# Altium schematic sheet ip_phone_codec.SchDoc: CODEC
size A3; SheetNumber: 3; SheetTotal: 6
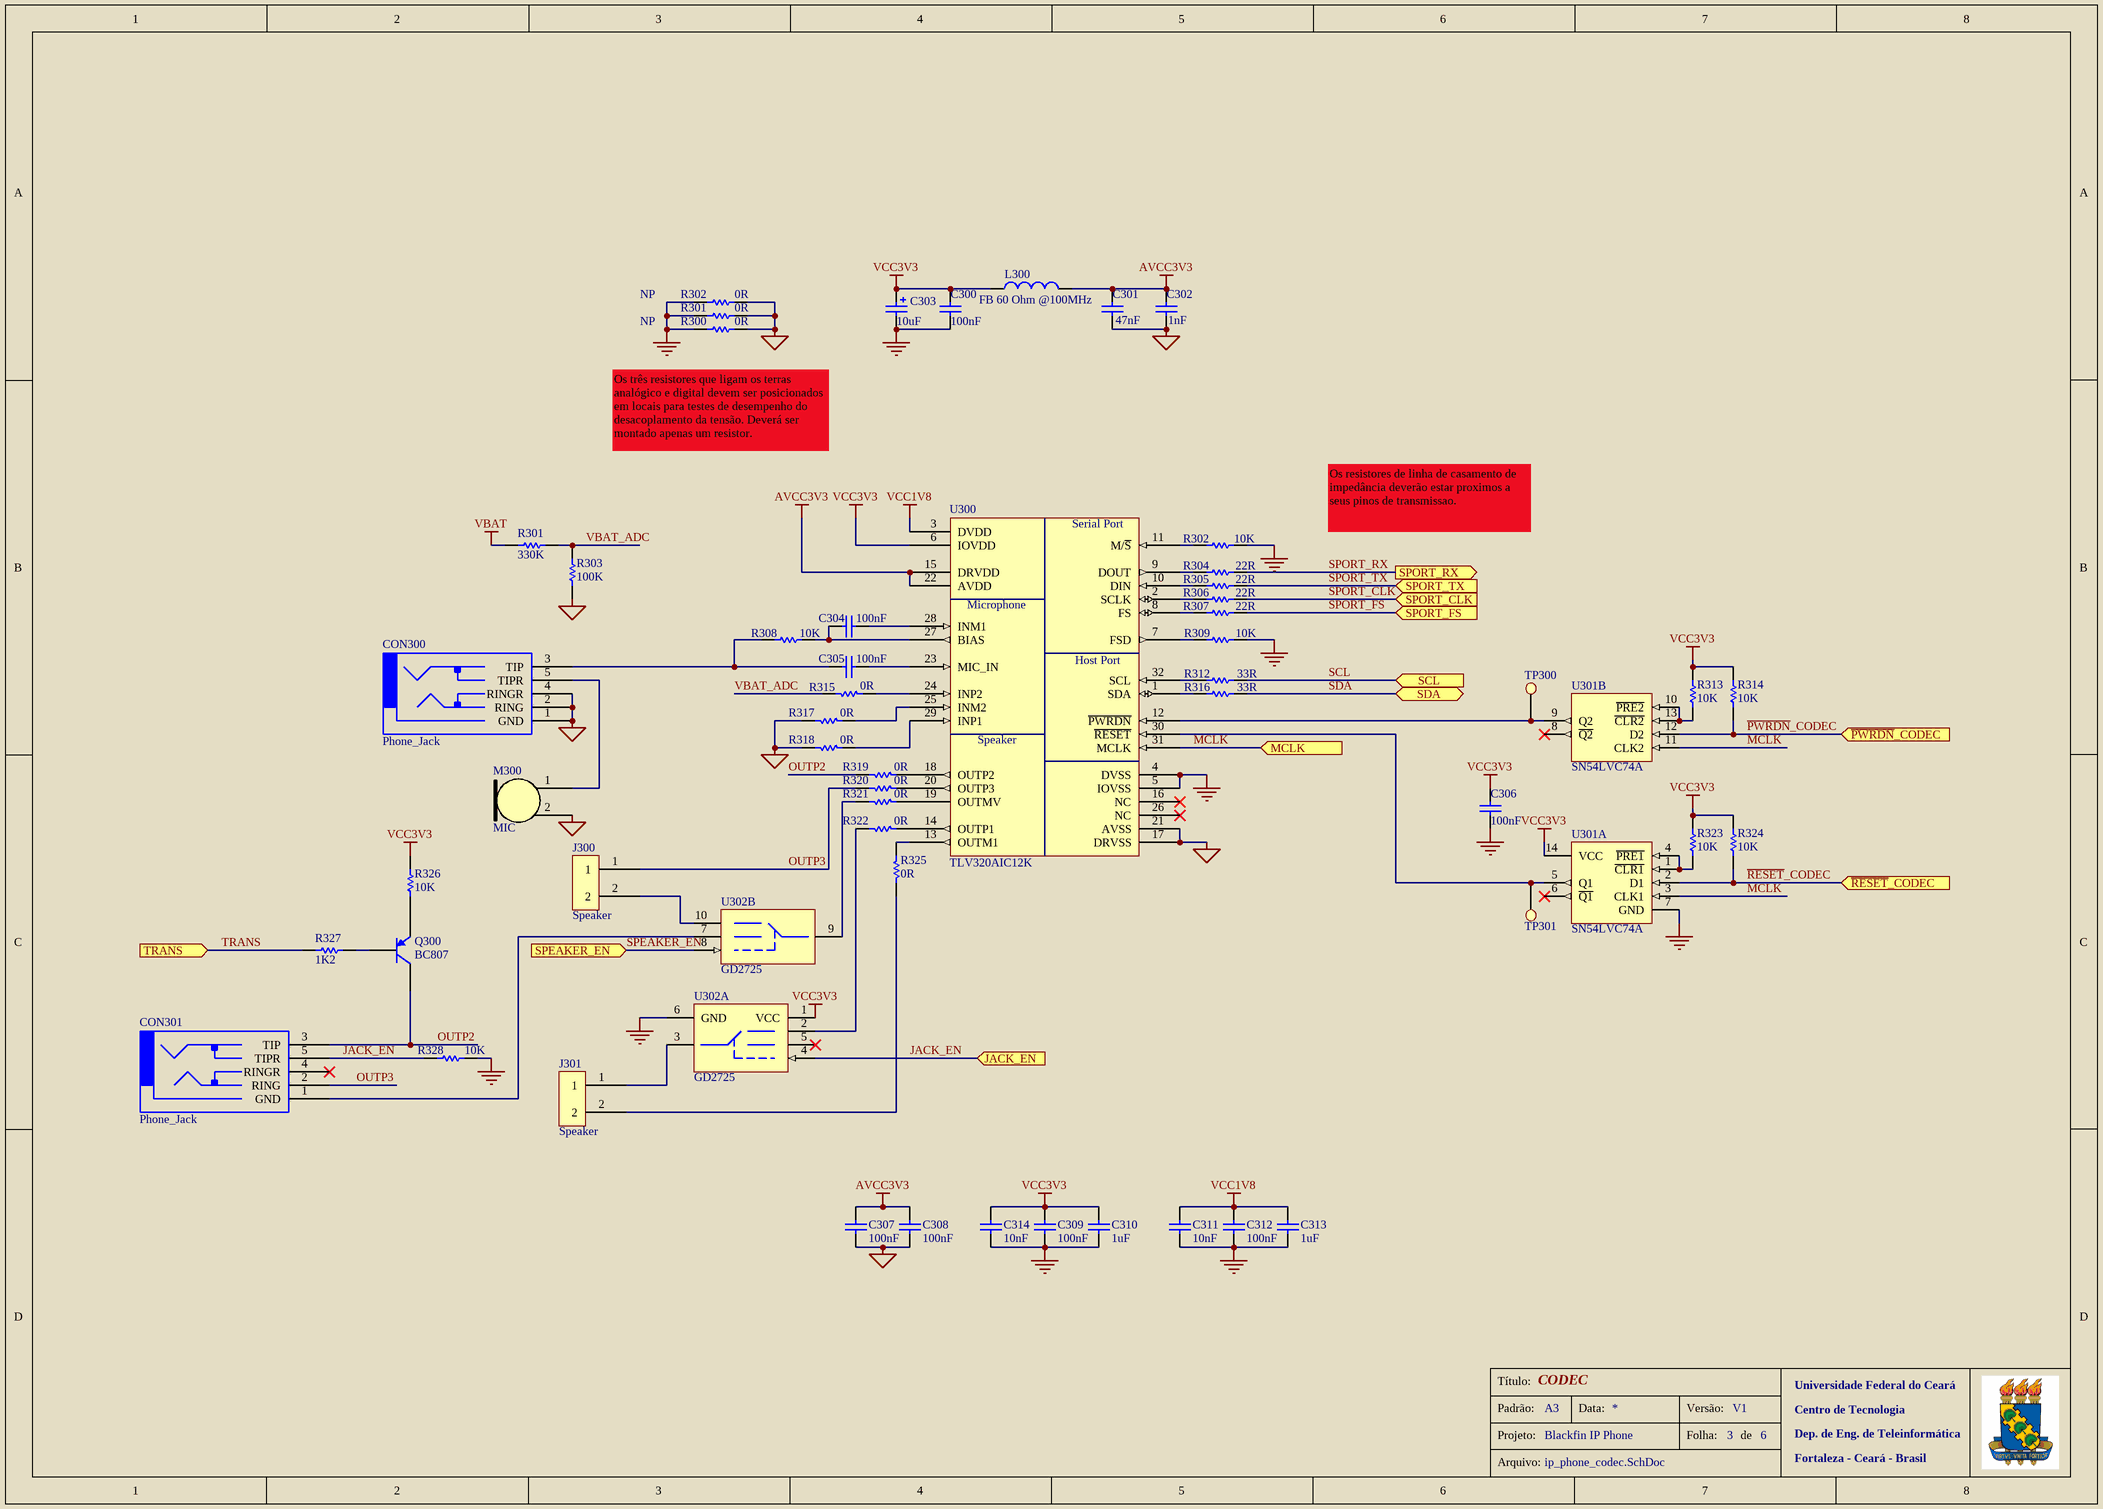
[diagram p0: ip_phone_codec.SchDoc]

## Parts
(Parts that share a designator on the sheet are numbered #1, #2 ... from top to bottom, then left to right.)
C300  100nF  [CC1005-0402]
C301  47nF  [CC1005-0402]
C302  1nF  [CC1005-0402]
C303  10uF  [VE-100M0JTR-0305]
C304  100nF  [CC1005-0402]
C305  100nF  [CC1005-0402]
C306  100nF  [CC1005-0402]
C307  100nF  [CC1005-0402]
C308  100nF  [CC1005-0402]
C309  100nF  [CC1005-0402]
C310  1uF  [CC1005-0402]
C311  10nF  [CC1005-0402]
C312  100nF  [CC1005-0402]
C313  1uF  [CC1005-0402]
C314  10nF  [CC1005-0402]
CON300  Phone_Jack  [Phone_Jack - 3.5]
CON301  Phone_Jack  [Phone_Jack - 3.5]
J300  Speaker  [HEADER_SPEAKER]
J301  Speaker  [HEADER_SPEAKER]
L300  FB 60 Ohm @100MHz  [INDUTOR_0603]
M300  MIC  [MIC]
Q300  BC807  [SOT323_N]
R300  0R  [CR1608-0603]
R301#1  0R  [CR1608-0603]
R301#2  330K  [CR1005-0402]
R302#1  0R  [CR1608-0603]
R302#2  10K  [CR1005-0402]
R303  100K  [CR1005-0402]
R304  22R  [CR1005-0402]
R305  22R  [CR1005-0402]
R306  22R  [CR1005-0402]
R307  22R  [CR1005-0402]
R308  10K  [CR1005-0402]
R309  10K  [CR1005-0402]
R312  33R  [CR1005-0402]
R313  10K  [CR1005-0402]
R314  10K  [CR1005-0402]
R315  0R  [CR1005-0402]
R316  33R  [CR1005-0402]
R317  0R  [CR1005-0402]
R318  0R  [CR1005-0402]
R319  0R  [CR1005-0402]
R320  0R  [CR1005-0402]
R321  0R  [CR1005-0402]
R322  0R  [CR1005-0402]
R323  10K  [CR1005-0402]
R324  10K  [CR1005-0402]
R325  0R  [CR1005-0402]
R326  10K  [CR1005-0402]
R327  1K2  [CR1005-0402]
R328  10K  [CR1005-0402]
TP300  Test Point  [Test Point]  (value not drawn)  (no BOM)
TP301  Test Point  [Test Point]  (value not drawn)  (no BOM)
U300  TLV320AIC12K  [PVQFN-32]
U301  SN54LVC74A  [SOIC14]  (parts A,B of 2)
U302  GD2725  [QFN10]  (parts A,B of 2)

## Ports
JACK_EN (in), MCLK (in), SCL (in), SDA (bidir), SPEAKER_EN (in), SPORT_CLK (in), SPORT_FS (in), SPORT_RX (out), SPORT_TX (in), TRANS (in), ~{PWRDN}_CODEC (in), ~{RESET}_CODEC (in)

## Nets
AGND: C301.1 C302.1 C307.1 C308.1 CON300.1(GND) CON300.2(RING) CON300.4(RINGR) M300.2(GND) R300.1 R301#1.1 R302#1.1 R303.1 R317.2 R318.2 U300.17(DRVSS) U300.21(AVSS)
AVCC3V3: C301.2 C302.2 C307.2 C308.2 L300.2 U300.15(DRVDD) U300.22(AVDD)
GND: C300.1 C303.2 C306.1 C309.2 C310.2 C311.1 C312.1 C313.1 C314.1 R300.2 R301#1.2 R302#1.2 R302#2.2 R309.2 R328.2 U300.4(DVSS) U300.5(IOVSS) U301.7(GND) U302.6(GND)
VBAT: R301#2.1
VCC1V8: C311.2 C312.2 C313.2 U300.3(DVDD)
VCC3V3: C300.2 C303.1 C306.2 C309.1 C310.1 C314.2 L300.1 R313.2 R314.2 R323.2 R324.2 R326.2 U300.6(IOVDD) U301.14(VCC) U302.1(VCC)
JACK_EN: CON301.5(TIPR) R328.1 U302.4(IN1) ; port JACK_EN
MCLK: U300.31(MCLK) U301.3(CLK1) U301.11(CLK2) ; port MCLK
OUTP2: CON301.3(TIP) Q300.2(E) R319.2
OUTP3: CON301.2(RING) J300.1 R320.2
~{PWRDN}_CODEC: R314.1 U301.12(D2) ; port ~{PWRDN}_CODEC
~{RESET}_CODEC: R324.1 U301.2(D1) ; port ~{RESET}_CODEC
SCL: R312.2 ; port SCL
SDA: R316.2 ; port SDA
SPEAKER_EN: U302.8(IN2) ; port SPEAKER_EN
SPORT_CLK: R306.2 ; port SPORT_CLK
SPORT_FS: R307.2 ; port SPORT_FS
SPORT_RX: R304.2 ; port SPORT_RX
SPORT_TX: R305.2 ; port SPORT_TX
TRANS: R327.1 ; port TRANS
VBAT_ADC: R301#2.2 R303.2 R315.2
NetC304_1: C304.1 U300.28(INM1)
NetC304_2: C304.2 R308.2 U300.27(BIAS)
NetC305_1: C305.1 U300.23(MIC_IN)
NetC305_2: C305.2 CON300.3(TIP) R308.1
NetCON300_5: CON300.5(TIPR) M300.1(OUT)
NetCON301_1: CON301.1(GND) U302.7(NC2)
NetJ300_2: J300.2 U302.10(NO2)
NetJ301_1: J301.1 U302.3(COM1)
NetJ301_2: J301.2 R325.2
NetQ300_1: Q300.1(B) R327.2
NetQ300_3: Q300.3(C) R326.1
NetR302#2_1: R302#2.1 U300.11(M/~{S})
NetR304_1: R304.1 U300.9(DOUT)
NetR305_1: R305.1 U300.10(DIN)
NetR306_1: R306.1 U300.2(SCLK)
NetR307_1: R307.1 U300.8(FS)
NetR309_1: R309.1 U300.7(FSD)
NetR312_1: R312.1 U300.32(SCL)
NetR313_1: R313.1 U301.10(~{PRE2}) U301.13(~{CLR2})
NetR315_1: R315.1 U300.24(INP2)
NetR316_1: R316.1 U300.1(SDA)
NetR317_1: R317.1 U300.25(INM2)
NetR318_1: R318.1 U300.29(INP1)
NetR319_1: R319.1 U300.18(OUTP2)
NetR320_1: R320.1 U300.20(OUTP3)
NetR321_1: R321.1 U300.19(OUTMV)
NetR321_2: R321.2 U302.9(COM2)
NetR322_1: R322.1 U300.14(OUTP1)
NetR322_2: R322.2 U302.2(NO1)
NetR323_1: R323.1 U301.1(~{CLR1}) U301.4(~{PRE1})
NetR325_1: R325.1 U300.13(OUTM1)
NetTP300_1: TP300.1 U300.12(~{PWRDN}) U301.9(Q2)
NetTP301_1: TP301.1 U300.30(~{RESET}) U301.5(Q1)

Not connected (* = marked no-connect by the designer): CON301 4(RINGR)*; U300 16(NC)* 26(NC)*; U301 6(~{Q1})* 8(~{Q2})*; U302 5(NC1)*

## Notes on the sheet
- Os três resistores que ligam os terras analógico e digital devem ser posicionados em locais para testes de desempenho do desacoplamento da tensão. Deverá ser montado apenas um resistor.
- Os resistores de linha de casamento de impedância deverão estar proximos a seus pinos de transmissao.
- Título:
- Universidade Federal do Ceará
- Padrão:
- Projeto:
- A3
- Blackfin IP Phone
- Data:
- Versão:
- Folha:
- V1
- de
- Centro de Tecnologia
- Dep. de Eng. de Teleinformática
- Fortaleza - Ceará - Brasil
- Arquivo:
- (in symbol TLV320AIC12K) Serial Port; Microphone; Host Port; Speaker

## Library data of the parts
C300 = Capacitor: MLCC - SMD/SMT 100nF 16V 10% 0402; eVendorPart#: 810-C1005X7R1C104K; Manufacturer: TDK; Part#: C1005X7R1C104KT; eVendor: Mouser; eVendorPrice: 0,03; MSRP: 0,005; MOQ: 1000
C301 = Capacitor: MLCC - SMD/SMT 47nF 16V 10% 0402; eVendorPart#: 311-1334-1-ND; Manufacturer: Yageo; Part#: CC0402KRX7R6BB473; eVendor: Digikey; eVendorPrice: 0,02; MSRP: 0,00429; MOQ: 1000
C302 = Capacitor: MLCC - SMD/SMT 1nF 16V 10% 0402; eVendorPart#: 311-1352-1-ND; Manufacturer: Yageo; Part#: CC0402KRX7R7BB102; eVendor: Digikey; eVendorPrice: 0,015; MSRP: 0,00335; MOQ: 1000
C303 = Capacitor_Electrolytic: Aluminum Electrolytic Capacitors - SMD 6.3 Volts 10uF 20%; eVendorPart#: 140-VE100M0JTR0305; Manufacturer: Lelon; eVendor: Mouser; MSRP: 0,099; eVendorPrice: 0,18; Part#: VE-100M0JTR-0305; MOQ: 1000
C304-C309 C312 = Capacitor: MLCC - SMD/SMT 0.1UF 16V 10% 0402; eVendorPart#: 810-C1005X7R1C104K; Manufacturer: TDK; Part#: C1005X7R1C104KT; eVendor: Mouser; eVendorPrice: 0,03; MSRP: 0,005; MOQ: 1000
C310 C313 = Capacitor: CAP CER 1.0UF 6.3V 20% X5R 0402; eVendorPart#: 490-1319-1-ND; Manufacturer: Murata Electronics North America; Part#: GRM155R60J105ME19D; eVendor: Digikey; eVendorPrice: 0,055; MSRP: 0,01193; MOQ: 1000
C311 C314 = Capacitor: Ceramic Capacitor 10nF 50V X7R 0402; eVendorPart#: 810-C1005X7R1C103K; Manufacturer: TDK; Part#: C1005X7R1C103KT; eVendor: Mouser; eVendorPrice: 0,03; MSRP: 0,004; MOQ: 1000
CON300 CON301 = Phone_Jack: CONN JACK STEREO 5PIN 3.5MM; eVendorPart#: 502-35RAPC4BHN2; Manufacturer: Switchcraft; Part#: 35RAPC4BHN2; eVendorPrice: 1,02; eVendor: Mouser; MSRP: 0,636; MOQ: 1000
J300 J301 = Speaker_con: eVendor: *; eVendorPart#: *; eVendorPrice: *; Manufacturer: *; MOQ: *; MSRP: *; Part#: *
L300 = Inductor: Ferrite Bead 60 Ohm @100MHz; eVendorPart#: 667-EXC-3BP600H; Manufacturer: Panasonic Electronic Components; Part#: EXC-3BP600H; eVendor: Mouser; eVendorPrice: 0,11; MSRP: 0,066; MOQ: 1000
M300 = MIC: Microphones -38DB 2VDC .5MA 2.2KOHM; Part#: POM-2738P-C33-R; Manufacturer: PUI Audio; eVendorPart#: 665-POM2738PC33R; eVendor: Mouser; eVendorPrice: 1,98; MSRP: 1,13; MOQ: 500
Q300 = TRAN_BC807: 45 V, 500 mA PNP general-purpose transistors; Manufacturer: ON Semiconductor; Part#: BC807-25WT1G; eVendorPart#: 863-BC807-25WT1G; eVendor: Mouser; eVendorPrice: 0,03; MSRP: 0,017; MOQ: 1000
R300 R301#1 R302#1 = Resistor: Thick Film Resistors ZERO OHM; eVendorPart#: 652-CR0603-J/-000ELF; Manufacturer: Bourns; Part#: CR0603-J/-000ELF; eVendor: Mouser; eVendorPrice: 0,02; MSRP: 0,008; MOQ: 1000
  R300 R302#1: NP: NP
R301#2 = Resistor: Thick Film Resistor 330K 1% 1/16W; eVendorPart#: RMCF0402FT330KCT-ND; Manufacturer: Stackpole Electronics Inc; Part#: RMCF0402FT330K; eVendor: Digikey; eVendorPrice: 0,04; MSRP: 0,00384; MOQ: 1000
R302#2 R309 R313 R314 R323 R324 R326 R328 = Resistor: Thick Film Resistors SMD 0402 10K 5%  1/16 W; eVendorPart#: 311-10KJRCT-ND; Manufacturer: Yageo; Part#: RC0402JR-0710KL; eVendor: Digikey; eVendorPrice: 0,012; MSRP: 0,00253; MOQ: 1000
R303 = Resistor: Thick Film Resistor 100K 1% 1/16W; eVendorPart#: 311-100KLRCT-ND; Manufacturer: Yageo; Part#: RC0402FR-07100KL; eVendor: Digikey; eVendorPrice: 0,014; MSRP: 0,00288; MOQ: 1000
R304-R307 = Resistor: Thick Film Resistors SMD 0402 22R 5%  1/16 W; eVendorPart#: 71-CRCW0402J-22-E3; Manufacturer: Vishay/Dale; Part#: CRCW040222R0JNED; eVendor: Mouser; eVendorPrice: 0,08; MSRP: 0,015; MOQ: 1000
R308 = Resistor: Thick Film Resistors SMD 0402 10k 5%  1/16 W; eVendorPart#: 311-10KJRCT-ND; Manufacturer: Yageo; Part#: RC0402JR-0710KL; eVendor: Digikey; eVendorPrice: 0,012; MSRP: 0,00253; MOQ: 1000
R312 R316 = Resistor: Thick Film Resistors SMD 0402 33R 5%  1/16 W; eVendorPart#: 311-33JRCT-ND; Manufacturer: Yageo; Part#: RC0402JR-0733RL; eVendor: Digikey; eVendorPrice: 0,012; MSRP: 0,00253; MOQ: 1000
R315 R317-R322 R325 = Resistor: Thick Film Resistors 0402 1/16W Jumper; eVendorPart#: 667-ERJ-2GE0R00X; Manufacturer: Panasonic Electronic Components; Part#: ERJ-2GE0R00X; eVendor: Mouser; eVendorPrice: 0,05; MSRP: 0,004; MOQ: 1000
R327 = Resistor: Thick Film Resistors SMD 0402 1K2 5%  1/16 W; eVendorPart#: 311-1.2KJRCT-ND; Manufacturer: Yageo; Part#: RC0402JR-071K2L; eVendor: Digikey; eVendorPrice: 0,012; MSRP: 0,00253; MOQ: 1000
TP300 TP301 = Test Point: eVendor: NÃO SE APLICA; eVendorPrice: 0,00; eVendorPart#: NÃO SE APLICA; Part#: NÃO SE APLICA; Manufacturer: NÃO SE APLICA; MOQ: 1000; MSRP: 0,00
U300 = TLV320AIC12K: IC Codec 16 bits 26KSPS 32VQFN; Manufacturer: Texas Instruments; Part#: TLV320AIC12KIRHBR; eVendorPart#: 296-21521-1-ND; eVendor: Digikey; eVendorPrice: 4,8; MSRP: 2,4; MOQ: 1000
U301 = SN54LVC74A: Dual D-Type Flip-Flop with Set and Reset; Manufacturer: Texas Instruments; Part#: SN74LVC74ADR; eVendorPart#: 595-SN74LVC74ADR; eVendor: Mouser; eVendorPrice: 0,50; MSRP: 0,138; MOQ: 1000
U302 = DG2725: Dual SPDT Analog Switch; eVendorPart#: 781-DG2725DN-T1-GE4; Part#: DG2725DN-T1-GE4; Manufacturer: Vishay/Siliconix; eVendor: Mouser; eVendorPrice: 0,69; MSRP: 0,30; MOQ: 1000